# EAGLE design pcb (EAGLE 9.6.2)
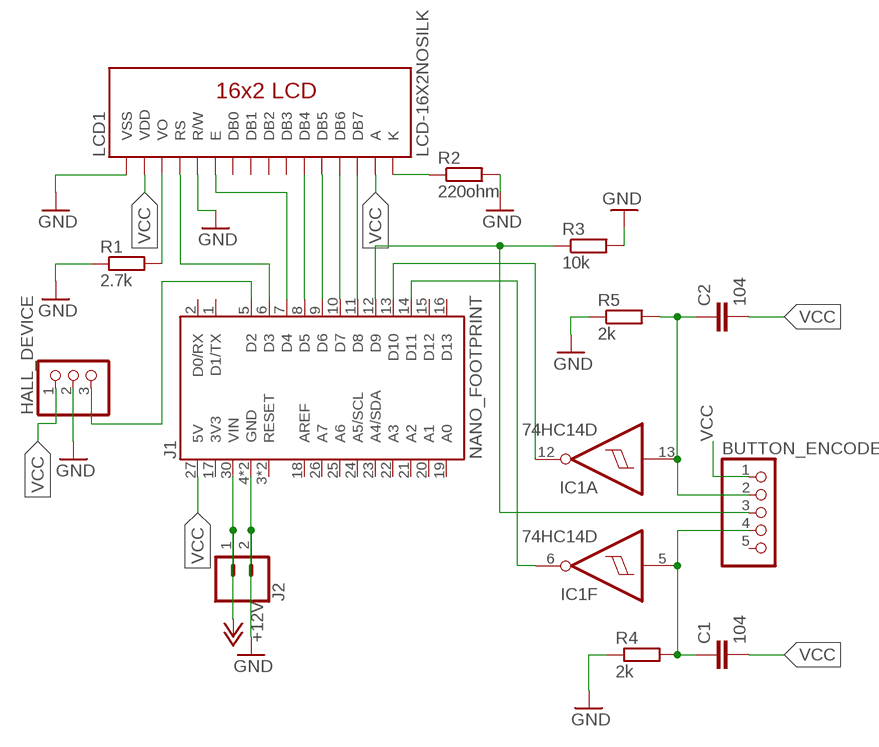
[diagram p0: schematic, sheet 1]

## Parts
BUTTON_ENCODER  PINHD-1X5  [1X05]
C1  104  C-EUC0805  [C0805]
C2  104  C-EUC0805  [C0805]
HALL_DEVICE  PINHD-1X3  [1X03]
IC1  74HC14D  [SO14]
J1  NANO_FOOTPRINT  [NANO]
J2  CONN_02  [1X02]
LCD1  LCD-16X2NOSILK  [LCD-16X2_NOSILK]
R1  2.7k  R-EU_R0805  [R0805]
R2  220ohm  R-EU_R0805  [R0805]
R3  10k  R-EU_R0805  [R0805]
R4  2k  R-EU_R0805  [R0805]
R5  2k  R-EU_R0805  [R0805]

## Nets
+12V: J1.30(VIN) J2.1
GND: HALL_DEVICE.2 J1.4(GND) J1.29(GND) J2.2 LCD1.1(VSS) LCD1.5(R/W) R1.1 R2.2 R3.2 R4.1 R5.1
N$1: LCD1.3(VO) R1.2
N$2: LCD1.16(K) R2.1
N$3: J1.11(D8) LCD1.14(DB7)
N$4: J1.10(D7) LCD1.13(DB6)
N$5: J1.9(D6) LCD1.12(DB5)
N$6: J1.8(D5) LCD1.11(DB4)
N$7: J1.7(D4) LCD1.6(E)
N$8: J1.6(D3) LCD1.4(RS)
N$9: HALL_DEVICE.3 J1.5(D2)
N$10: BUTTON_ENCODER.3 J1.12(D9) R3.1
N$12: IC1.12(A:O) J1.13(D10)
N$13: IC1.6(F:O) J1.14(D11)
N$14: BUTTON_ENCODER.2 C2.1 IC1.13(A:I) R5.2
N$15: BUTTON_ENCODER.4 C1.1 IC1.5(F:I) R4.2
VCC: BUTTON_ENCODER.1 C1.2 C2.2 HALL_DEVICE.1 J1.27(5V) LCD1.2(VDD) LCD1.15(A)
Unconnected: BUTTON_ENCODER.5 IC1.1(D:I) IC1.2(D:O) IC1.3(E:I) IC1.4(E:O) IC1.8(C:O) IC1.9(C:I) IC1.10(B:O) IC1.11(B:I) J1.1(D1/TX) J1.2(D0/RX) J1.3(RESET) J1.15(D12) J1.16(D13) J1.17(3V3) J1.18(AREF) J1.19(A0) J1.20(A1) J1.21(A2) J1.22(A3) J1.23(A4/SDA) J1.24(A5/SCL) J1.25(A6) J1.26(A7) J1.28(RESET) LCD1.7(DB0) LCD1.8(DB1) LCD1.9(DB2) LCD1.10(DB3)

## Power pins joined to a net without a drawn wire
GND: IC1.7(P:GND)
VCC: IC1.14(P:VCC)

## Library data of the parts
BUTTON_ENCODER = pinhead:PINHD-1X5: PIN HEADER
C1 C2 = rcl:C-EU: CAPACITOR, European symbol; SPICEPREFIX: C
HALL_DEVICE = pinhead:PINHD-1X3: PIN HEADER
IC1 = 74xx-eu:74*14: Hex schmitt trigger INVERTER
J1 = SparkFun-Boards:NANO_FOOTPRINT: Generic Nano Footprint
J2 = SparkFun-Connectors:CONN_02: Multi connection point. Often used as Generic Header-pin footprint for 0.1 inch spaced/style header connections On any of the 0.1 inch spaced packages, you can populate with these: Break Away Headers - Straight <https://www.sparkfun.com/products/116> (PRT-00116) Break Away Male Headers - Right Angle <https://www.sparkfun.com/products/553> (PRT-00553) Female Headers <https://www.sparkfun.com/products/115> (PRT-00115) Break Away Headers - Machine Pin <https://www.sparkfun.com/products/117> (PRT-00117) Break Away Female Headers - Swiss Machine Pin <https://www.sparkfun.com/products/743> (PRT-00743) For SCREWTERMINALS and SPRING TERMINALS visit here: Screw Terimnals on SparkFun.com <https://www.sparkfun.com/search/results?term=Screw+Terminals> (5mm/3.5mm/2.54mm spacing) This device is also useful as a general connection point to wire up your design to another part of your project. Our various solder wires solder well into these plated through hole pads. Hook-Up Wire - Assortment (Stranded, 22 AWG) <https://www.sparkfun.com/products/11375> (PRT-11375) Hook-Up Wire - Assortment (Solid Core, 22 AWG) <https://www.sparkfun.com/products/11367> (PRT-11367) View the entire wire category on our website here <https://www.sparkfun.com/categories/141> Special notes: Molex polarized connector foot print use with: PRT-08233 with associated crimp pins and housings. 2.54_SCREWTERM for use with PRT-10571. 3.5mm Screw Terminal footprints for PRT-08084 5mm Screw Terminal footprints for use with PRT-08432
LCD1 = SparkFun-Displays:LCD-16X2: Standard text-only 16x2 parallel input LCD Basic 16 character by 2 line display. Typically utilizes the extremely common HD44780 parallel interface chipset SparkFun Products: Basic 16x2 Green <https://www.sparkfun.com/products/255> Basic 8x2 Green <https://www.sparkfun.com/products/11122>; SF_ID: LCD-00255
R1-R5 = rcl:R-EU_: RESISTOR, European symbol; SPICEPREFIX: R

## Board
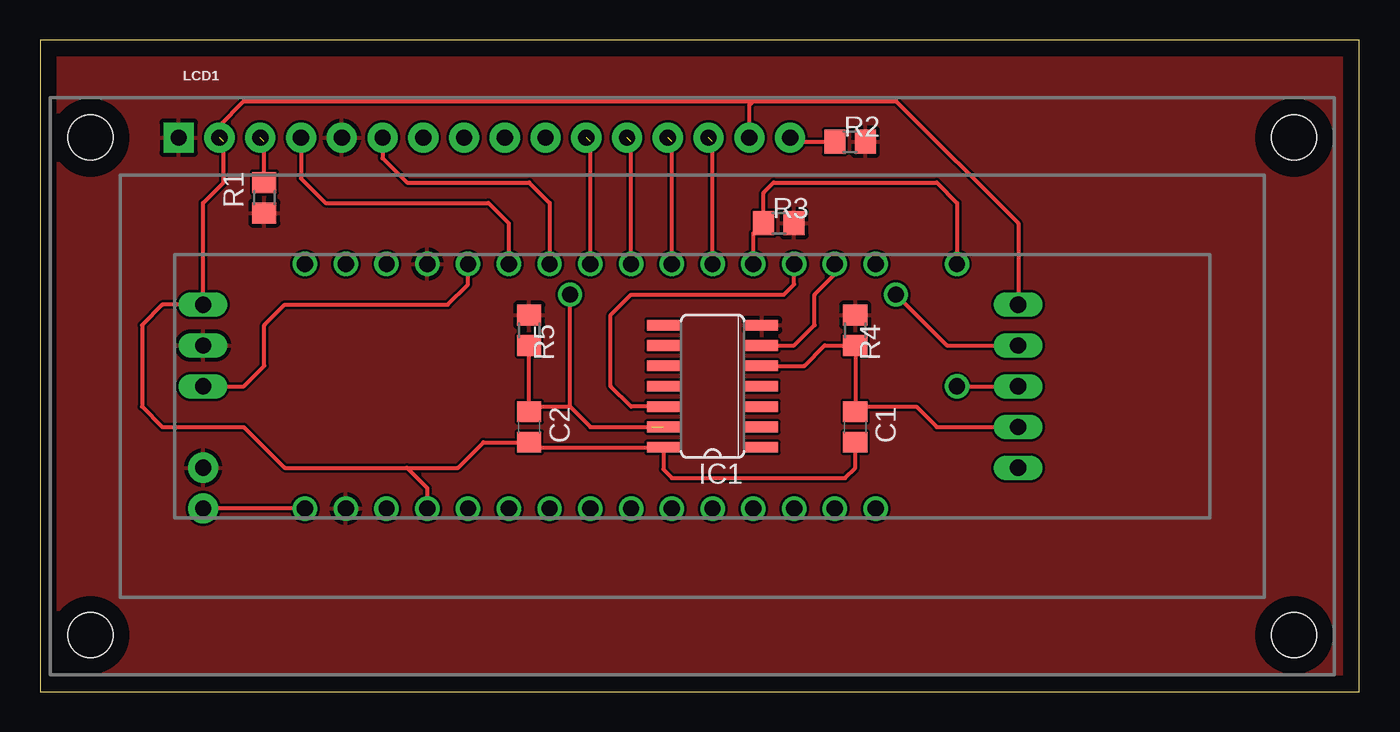
[diagram p1: board, top side]
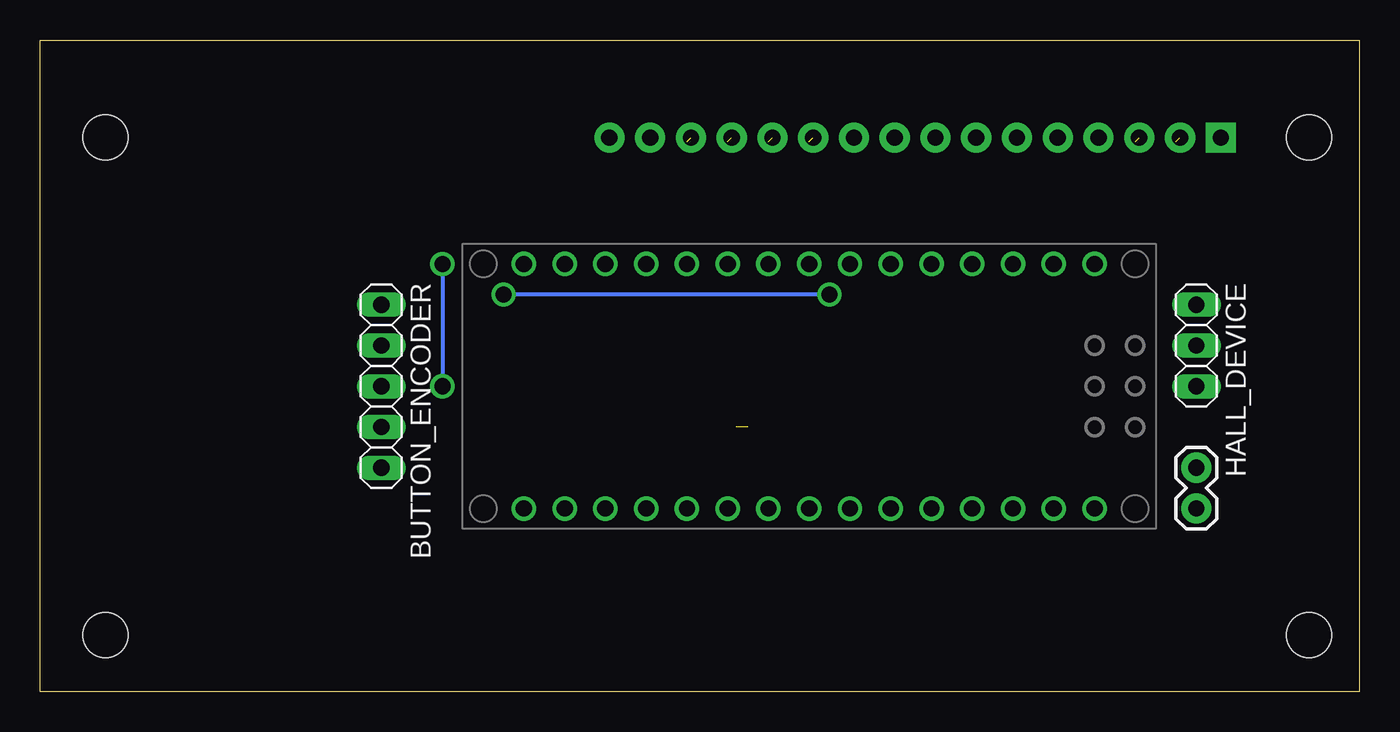
[diagram p2: board, bottom side, seen from below]

Size 82.22 x 40.63 mm. Coordinates in mm from the lower left corner, seen from the top.
Outline: 0,0 82.22,0 82.22,40.63 0,40.63 0,0
Copper layers (1*16): Top 0.035mm / dielectric 1.5mm / Bottom 0.035mm
Design rules "default": minimum track width 6mil, minimum drill 0.35mm, track to track 6mil, track to pad 6mil, pad to pad 6mil, via to via 6mil, smd to smd 6mil, copper to edge 40mil, drill to drill 6mil, minimum pad ring 10mil, minimum via ring 8mil, stop-mask expansion 4mil, vias tented up to drill 0mil, thermal gap 10mil

### Footprints (pad centres in the part's own frame; a part is rotated, then mirrored left to right if it is on the bottom)
1X05 = drill 1.016 long: 1 -5.08,0; 2 -2.54,0; 3 0,0; 4 2.54,0; 5 5.08,0
C0805 = smd 1.3 x 1.5: 1 -0.95,0; 2 0.95,0
1X03 = drill 1.016 long: 1 -2.54,0; 2 0,0; 3 2.54,0
SO14 = smd 0.66 x 2.032: 1 -3.81,-3.073; 2 -2.54,-3.073; 3 -1.27,-3.073; 4 0,-3.073; 5 1.27,-3.073; 6 2.54,-3.073; 7 3.81,-3.073; 8 3.81,3.073; 9 2.54,3.073; 10 1.27,3.073; 11 0,3.073; 12 -1.27,3.073; 13 -2.54,3.073; 14 -3.81,3.073
NANO = drill 1.016: 1 -7.62,17.78; 2 -7.62,15.24; 3 -7.62,12.7; 4 -7.62,10.16; 5 -7.62,7.62; 6 -7.62,5.08; 7 -7.62,2.54; 8 -7.62,0; 9 -7.62,-2.54; 10 -7.62,-5.08; 11 -7.62,-7.62; 12 -7.62,-10.16; 13 -7.62,-12.7; 14 -7.62,-15.24; 15 -7.62,-17.78; 16 7.62,-17.78; 17 7.62,-15.24; 18 7.62,-12.7; 19 7.62,-10.16; 20 7.62,-7.62; 21 7.62,-5.08; 22 7.62,-2.54; 23 7.62,0; 24 7.62,2.54; 25 7.62,5.08; 26 7.62,7.62; 27 7.62,10.16; 28 7.62,12.7; 29 7.62,15.24; 30 7.62,17.78
1X02 = drill 1.016 pad 1.88: 1 0,0; 2 2.54,0
LCD-16X2_NOSILK = drill 1.016 pad 1.88 square: 1 -32,15.5 | drill 1.016 pad 1.88: 2 -29.46,15.5; 3 -26.92,15.5; 4 -24.38,15.5; 5 -21.84,15.5; 6 -19.3,15.5; 7 -16.76,15.5; 8 -14.22,15.5; 9 -11.68,15.5; 10 -9.14,15.5; 11 -6.6,15.5; 12 -4.06,15.5; 13 -1.52,15.5; 14 1.02,15.5; 15 3.56,15.5; 16 6.1,15.5 | hole 2.8: -37.5,15.5; -37.5,-15.5; 37.5,15.5; 37.5,-15.5
R0805 = smd 1.3 x 1.5: 1 -0.95,0; 2 0.95,0

### Placement (x,y rotation side)
BUTTON_ENCODER  60.96,19.05 270 bottom
C1  50.8,16.51 270 top
C2  30.48,16.51 270 top
HALL_DEVICE  10.16,21.59 270 bottom
IC1  41.91,19.05 90 top
J1  34.29,19.05 270 bottom
J2  10.16,11.43 90 bottom
LCD1  40.64,19.05 0 top
R1  13.97,30.8 90 top
R2  50.48,34.29 0 top
R3  46.04,29.21 0 top
R4  50.8,22.54 270 top
R5  30.48,22.54 270 top

### Tracks (layer width: path | path; a pad name or v marks a point on that pad's centre or on a via)
+12V
  Top 0.254: J1.30 J2.1
GND
  pour Top: 0,40.64 0,0 82.55,0 82.55,40.64
N$1  (1 unrouted)
  Top 0.254: R1.2 13.97,34.29
N$2
  Top 0.254: LCD1.16 46.99,34.3 R2.1
N$3  (1 unrouted)
  Top 0.254: J1.11 41.91,34.29
N$4  (1 unrouted)
  Top 0.254: J1.10 39.37,34.29
N$5  (1 unrouted)
  Top 0.254: J1.9 36.83,34.29
N$6  (1 unrouted)
  Top 0.254: J1.8 34.29,34.29
N$7
  Top 0.254: J1.7 31.75,30.48 30.48,31.75 22.86,31.75 21.34,33.27 LCD1.6
N$8
  Top 0.254: LCD1.4 16.26,32 17.78,30.48 27.94,30.48 29.21,29.21 J1.6
N$9
  Top 0.254: HALL_DEVICE.3 12.7,19.05 13.97,20.32 13.97,22.86 15.24,24.13 25.4,24.13 26.67,25.4 J1.5
N$10  (via drill 1)
  Top 0.254: J1.12 44.45,28.57 R3.1 45.09,31.12 45.72,31.75 55.88,31.75 57.15,30.48 v57.15,26.67 | v57.15,19.05 BUTTON_ENCODER.3
  Bottom 0.254: v57.15,26.67 v57.15,19.05
N$12
  Top 0.254: IC1.12 36.83,17.78 35.56,19.05 35.56,23.5 36.83,24.77 46.36,24.77 46.99,25.4 J1.13
N$13
  Top 0.254: IC1.6 46.99,21.59 48.26,22.86 48.26,24.77 49.53,26.04 J1.14
N$14  (via drill 1)  (1 unrouted)
  Top 0.254: R5.2 C2.1 30.8,17.78 33.02,17.78 | 33.02,17.78 34.29,16.51 38.1,16.51 | 33.02,17.78 v33.02,24.77 | v53.34,24.77 56.52,21.59 BUTTON_ENCODER.2
  Bottom 0.254: v33.02,24.77 v53.34,24.77
N$15
  Top 0.152: C1.1 51.12,17.78
  Top 0.254: C1.1 R4.2 48.9,21.59 47.62,20.32 IC1.5 | 51.12,17.78 54.61,17.78 55.88,16.51 BUTTON_ENCODER.4
VCC  (1 unrouted)
  Top 0.254: LCD1.2 11.18,35.31 12.7,36.83 44.45,36.83 | LCD1.15 44.2,36.58 44.45,36.83 | HALL_DEVICE.1 10.16,30.48 11.43,31.75 11.43,34.29 | HALL_DEVICE.1 8.89,24.13 | HALL_DEVICE.1 7.62,24.13 6.35,22.86 6.35,17.78 7.62,16.51 12.7,16.51 15.24,13.97 22.86,13.97 | 22.86,13.97 24.13,12.7 J1.27 | 44.45,36.83 53.34,36.83 60.96,29.21 BUTTON_ENCODER.1 | 22.86,13.97 26.04,13.97 27.62,15.56 C2.2 30.8,15.24 IC1.14 38.84,13.87 39.37,13.34 50.17,13.34 50.8,13.97 C1.2